# EasyEDA Pro project ProProject_Stc32f_Car副本_2024-06-03.epro, schematic schematic3_1
Create Date: 2024-03-13; Page Name: P1; Project Name: STC32F主板; Schematic Name: Schematic3; Update Date: 2024-04-25; Company: 嘉立创EDA; Page Size: A4; Version: V1.0
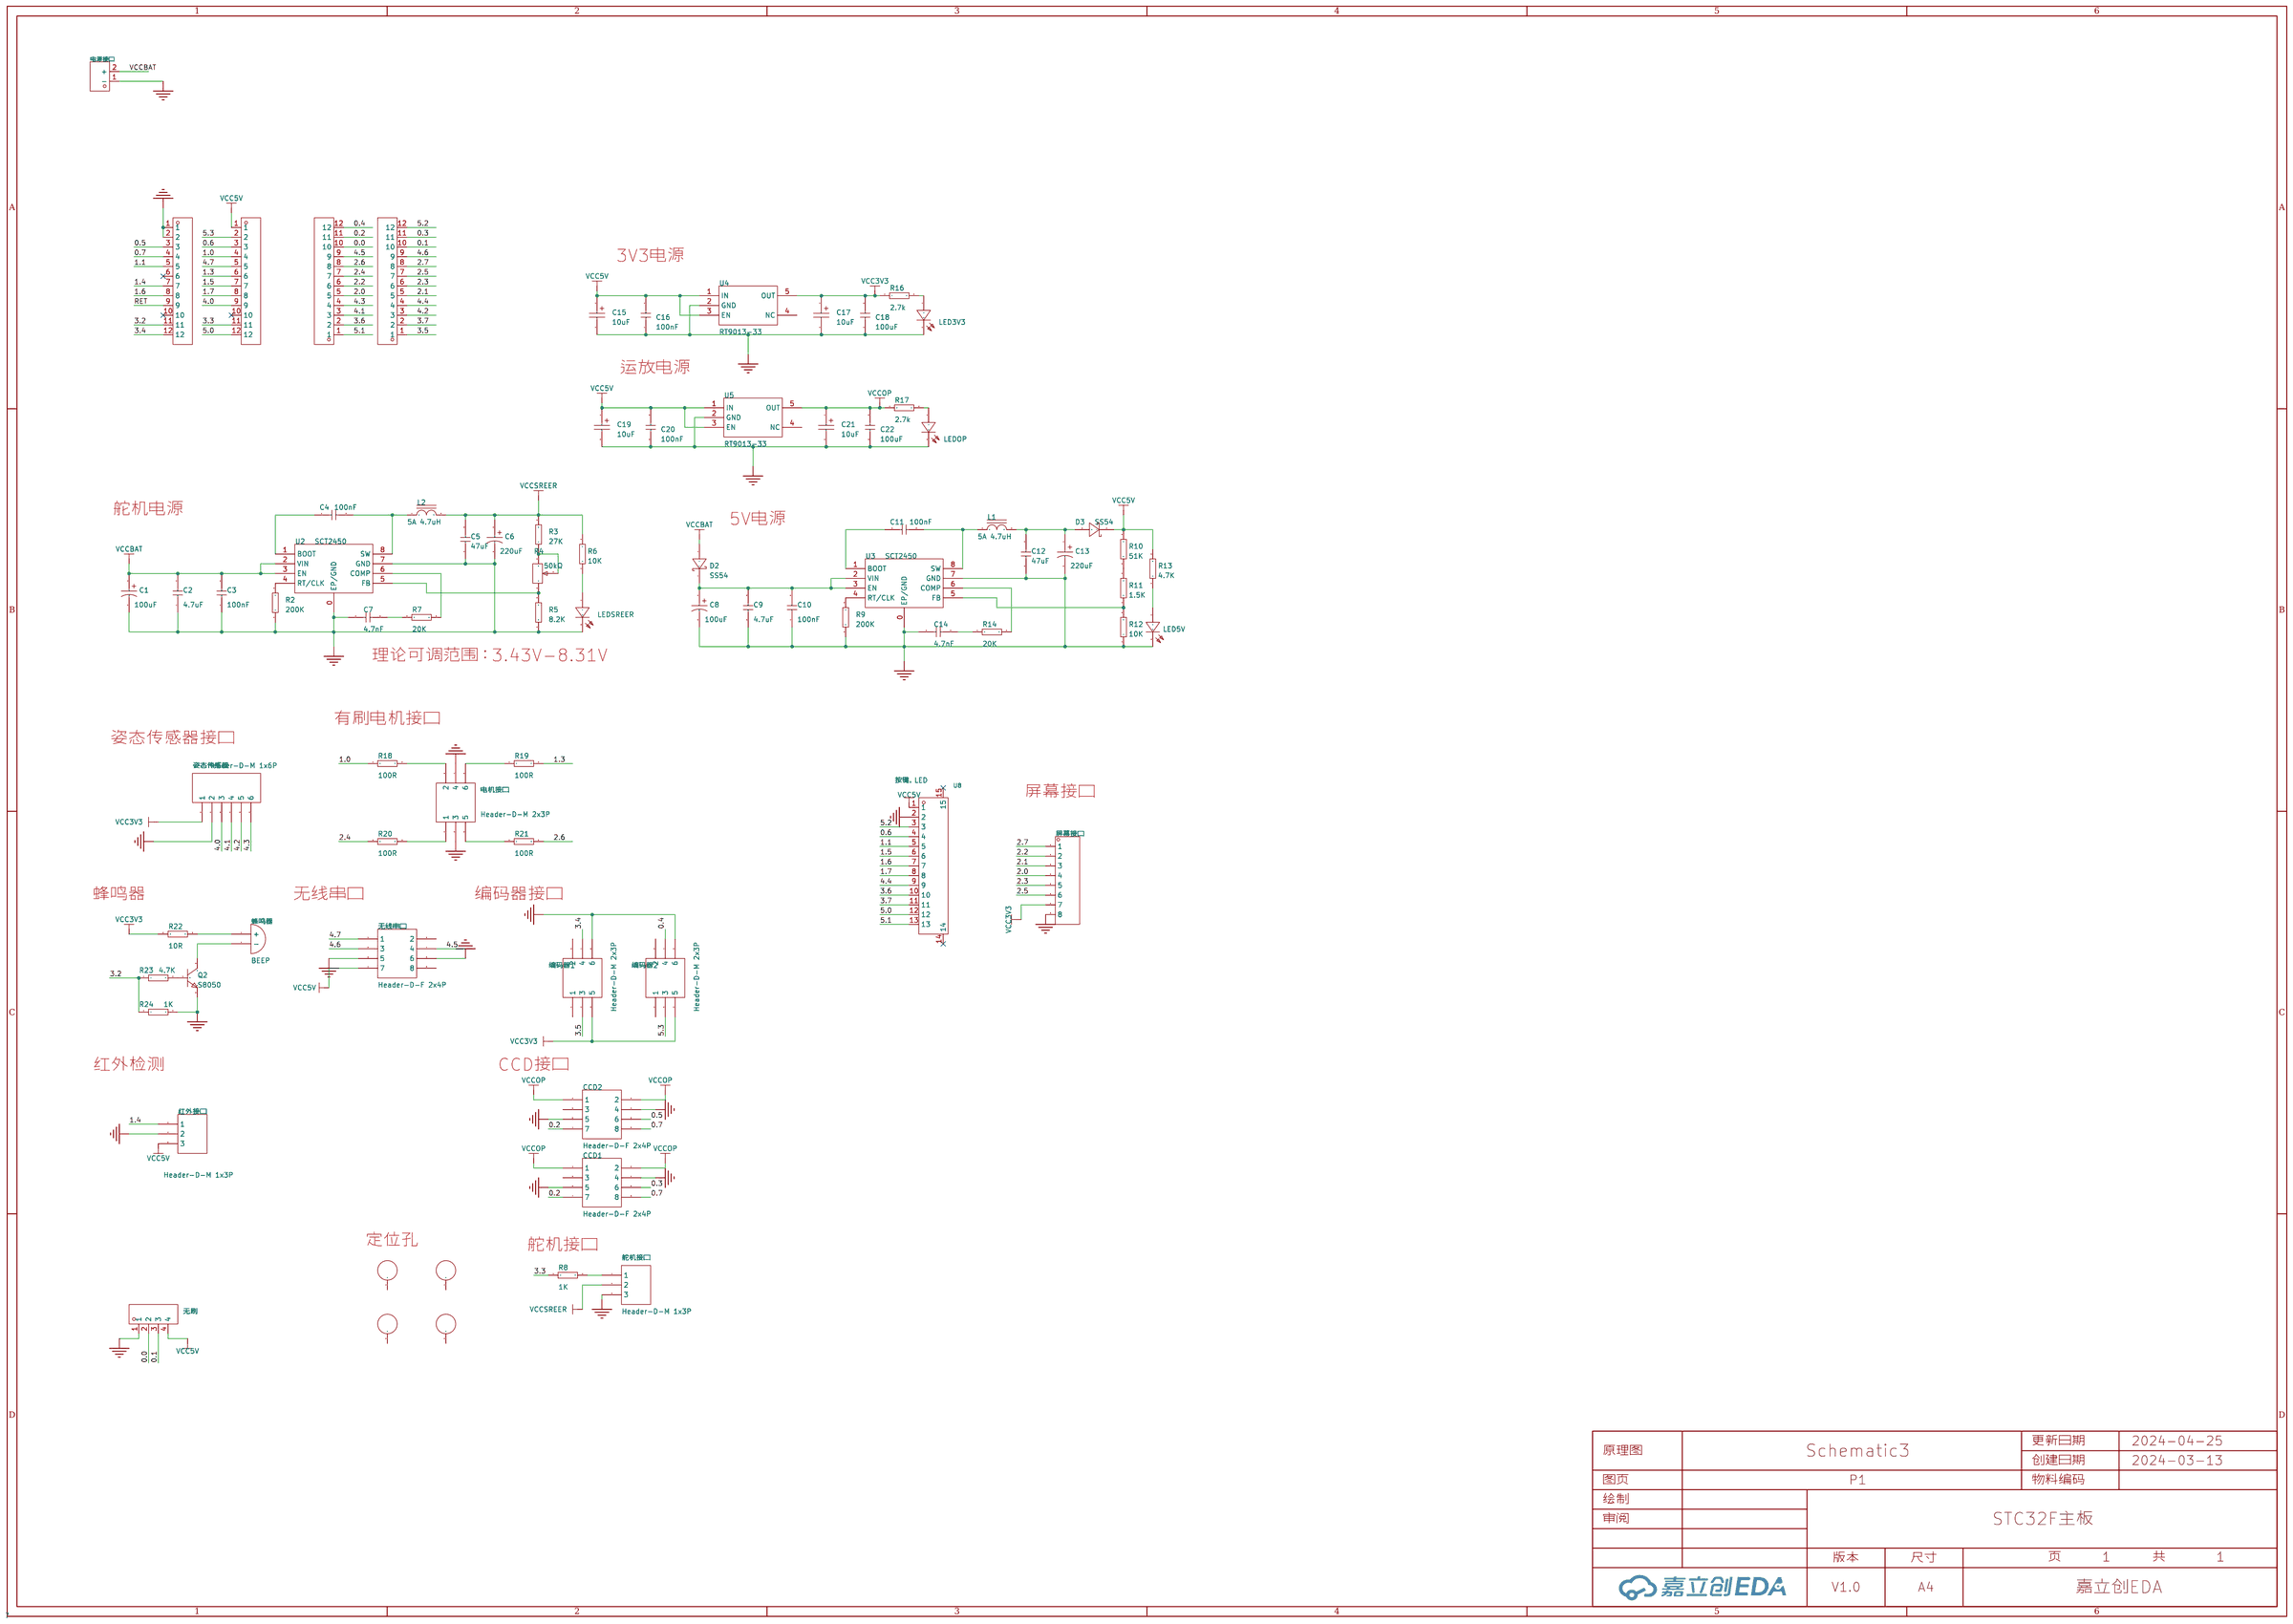
[diagram p1: schematic sheet]

## Parts
C1  100uF  [CAP-E-S 6.3]
C2  4.7uF  [CAPC3216[1206]S]
C3  100nF  [CAPC1608[0603]S-N]
C4  100nF  [CAPC1608[0603]S-N]
C5  47uF  [CAPC3216[1206]S]
C6  220uF  [CAP-E-S 6.3]
C7  4.7nF  [CAPC1608[0603]S-N]
C8  100uF  [CAP-E-S 6.3]
C9  4.7uF  [CAPC3216[1206]S]
C10  100nF  [CAPC1608[0603]S-N]
C11  100nF  [CAPC1608[0603]S-N]
C12  47uF  [CAPC3216[1206]S]
C13  220uF  [CAP-E-S 6.3]
C14  4.7nF  [CAPC1608[0603]S-N]
C15  10uF  [CAP-T-S 3216]
C16  100nF  [CAPC1608[0603]S-N]
C17  10uF  [CAP-T-S 3216]
C18  100nF  [CAPC1608[0603]S-N]
C19  10uF  [CAP-T-S 3216]
C20  100nF  [CAPC1608[0603]S-N]
C21  10uF  [CAP-T-S 3216]
C22  100nF  [CAPC1608[0603]S-N]
CCD1  Header-D-F 2x4P  [HDR2X4-F]
CCD2  Header-D-F 2x4P  [HDR2X4-F]
D2  SS54  [SMA-L[DO-214AC]]
D3  SS54  [SMA-L[DO-214AC]]
H1  -  [HDR-TH_12P-P2.54-V-F]
H2  -  [HDR-TH_12P-P2.54-V-F]
H3  -  [HDR-TH_12P-P2.54-V-F]
H4  -  [HDR-TH_12P-P2.54-V-F]
L1  4.7uH  [0630 TPC 7*7*3]
L2  4.7uH  [0630 TPC 7*7*3]
LED3V3  翠绿贴片LED  [LEDC1608(0603)-L]
LED5V  翠绿贴片LED  [LEDC1608(0603)-L]
LEDOP  翠绿贴片LED  [LEDC1608(0603)-L]
LEDSREER  翠绿贴片LED  [LEDC1608(0603)-L]
M1  MountHole  [M3-MountHole]
M2  MountHole  [M3-MountHole]
M3  MountHole  [M3-MountHole]
M4  MountHole  [M3-MountHole]
Q2  S8050  [SOT-23]
R2  200K  [RESC1608[0603]S-N]
R3  27K  [RESC1608[0603]S-N]
R4  50kΩ  [RES-ADJ-SMD_3224W]
R5  8.2K  [RESC1608[0603]S-N]
R6  10K  [RESC1608[0603]S-N]
R7  20K  [RESC1608[0603]S-N]
R8  1K  [RESC1608[0603]S-N]
R9  200K  [RESC1608[0603]S-N]
R10  51K  [RESC1608[0603]S-N]
R11  1.5K  [RESC1608[0603]S-N]
R12  10K  [RESC1608[0603]S-N]
R13  4.7K  [RESC1608[0603]S-N]
R14  20K  [RESC1608[0603]S-N]
R16  2.7K  [RESC1608[0603]S-N]
R17  2.7K  [RESC1608[0603]S-N]
R18  100R  [RESC1608[0603]S-N]
R19  100R  [RESC1608[0603]S-N]
R20  100R  [RESC1608[0603]S-N]
R21  100R  [RESC1608[0603]S-N]
R22  10R  [RESC1608[0603]S-N]
R23  4.7K  [RESC1608[0603]S-N]
R24  1K  [RESC1608[0603]S-N]
U2  SCT2450  [SOP-8E]
U3  SCT2450  [SOP-8E]
U4  RT9013-33  [SOT-23-5]
U5  RT9013-33  [SOT-23-5]
U8  按键，LED  [FPC-SMD_13P-P0.50_AFD01-S13FCA--00]
姿态传感器  Header-D-M 1x6P  [HDR1X6-M]
屏幕接口  -  [HDR-TH_8P-P2.54-V-M]
无刷  -  [HDR-TH_4P-P2.54-V-M]
无线串口  Header-D-F 2x4P  [HDR2X4-F]
电机接口  Header-D-M 2x3P  [HDR2X3-M]
电源接口  电源  [CONN-TH_XT30UPB-M]
红外接口  Header-D-M 1x3P  [HDR1X3-M]
编码器1  Header-D-M 2x3P  [HDR2X3-M]
编码器2  Header-D-M 2x3P  [HDR2X3-M]
舵机接口  Header-D-M 1x3P  [HDR1X3-M]
蜂鸣器  BEEP  [BEEP 9x5.5mm]

## Library data of the parts
C1 C8 = E-S 100uF 35V 6.3x7.7: Revision: V1.0; Type: 铝电解; Voltage: 35V
C2 C9 = 4.7uF 1206 35V X5R: Revision: V1.0; Voltage: 35V; Type: X5R; Origin Footprint 2: CAPC3216[1206]
C3 C4 C10 C11 C16 C18 C20 C22 = 100nF 0603 50V X7R: Revision: V1.0; Voltage: 50V; Type: X7R; Origin Footprint 2: CAPC1608[0603]-L; Origin Footprint 3: CAPC1608[0603]-M; Origin Footprint 4: CAPC1608[0603]-N; Origin Footprint 5: CAPC1608[0603]S-L; Origin Footprint 6: CAPC1608[0603]S-M
C5 C12 = 47uF 1206 25V X5R: Revision: V1.0; Voltage: 25V; Type: X5R; Origin Footprint 2: CAPC3216[1206]
C6 C13 = E-S 220uF 25V 6.3x7.7: Revision: V1.0; Type: 铝电解; Voltage: 25V
C7 C14 = 4.7nF 0603 50V X7R: Revision: V1.0; Voltage: 50V; Type: X7R; Origin Footprint 2: CAPC1608[0603]-L; Origin Footprint 3: CAPC1608[0603]-M; Origin Footprint 4: CAPC1608[0603]-N; Origin Footprint 5: CAPC1608[0603]S-L; Origin Footprint 6: CAPC1608[0603]S-M
C15 C17 C19 C21 = T-S 10uF 3216 16V: Revision: July-2002: Re-released for DXP Platform.; Type: TanCap; Voltage: 16V
CCD1 CCD2 无线串口 = Header-D-F 2x4P: Revision: V1.0
D2 D3 = SS54: Revision: V1.0
H1-H4 = HDR-F_2.54_1x12P: Supplier Part: C2905419; Supplier Footprint: 插件
L1 L2 = Ind-Power: Published: 8-Jun-2000; Revision: July-2002: Re-released for DXP Platform.; Publisher: Altium Limited; DCR: .5m; Price(RMB): 0.000; Imax: 5A; Origin Footprint 2: CD31; Origin Footprint 3: CD32; Origin Footprint 4: CD42; Origin Footprint 5: CD43; Origin Footprint 6: CD52; Origin Footprint 7: CD53; Origin Footprint 8: CD54; Origin Footprint 9: CD73; Origin Footprint 10: CD75; Origin Footprint 11: CD104; Origin Footprint 12: CD105; Origin Footprint 13: CD106; Origin Footprint 14: 127 Shielded 12.5*12.5*7; Origin Footprint 15: 1050 TPC 10*10*5; Origin Footprint 16: 1265 TPC 12*12*6.5; Origin Footprint 17: CD104R; Origin Footprint 18: SLO2520; Origin Footprint 19: 1365 TPC 13*13*6.5; Origin Footprint 20: INDUCTOR; Origin Footprint 21: 0402 TPC 4*4*2
LED3V3 LED5V LEDOP LEDSREER = LED Chip Green: Published: 8-Jun-2000; Revision: July-2002: Re-released for DXP Platform.; Publisher: Altium Limited; Price(RMB): 0.00; Origin Footprint 2: LEDC1608(0603); Origin Footprint 3: LEDC2012(0805); Origin Footprint 4: LEDC3216(1206); Origin Footprint 5: LEDC2012(0805)-L; Origin Footprint 6: LEDC3216(1204); Origin Footprint 7: LEDC3528-2
M1-M4 = MountHole: Origin Footprint 2: M3-MountSlot; Origin Footprint 3: M3-MountSlot-Plated; Origin Footprint 4: M3-MountHole-4mm; Origin Footprint 5: M3-MountHole-5mm; Origin Footprint 6: M3-MountHole-6mm; Origin Footprint 7: M3-MountHole-7mm; Origin Footprint 8: M3-MountHole-8mm; Origin Footprint 9: M3-MountHole-9mm; Origin Footprint 10: M3-MountHole-10mm; Origin Footprint 11: M3-MountHole-11mm; Origin Footprint 12: M3-MountHole-12mm; Origin Footprint 13: M3-MountHole-13mm; Origin Footprint 14: M3-MountHole-14mm; Origin Footprint 15: M3-MountHole-15mm; Origin Footprint 16: M3-MountHole-16mm; Origin Footprint 17: M3-MountHole-17mm; Origin Footprint 18: M3-MountHole-18mm; Origin Footprint 19: M3-MountHole-19mm; Origin Footprint 20: M3-MountHole-20mm; Origin Footprint 21: M3-MountHole-Plated-D5.2; Origin Footprint 22: M3-MountHole-Plated-D5.5; Origin Footprint 23: M3-MountHole-Plated-D6
Q2 = NPN S8050: Published: 8-Jun-2000; Revision: July-2002: Re-released for DXP Platform.; Publisher: Altium Limited; Price(RMB): 0.000
R2 R9 = Res-Chip_1: Revision: V1.0; Power: 1/8W; Tolerance: ±1%; Origin Footprint 2: RESC0603[0201]-L; Origin Footprint 3: RESC0603[0201]-M; Origin Footprint 4: RESC0603[0201]-N; Origin Footprint 5: RESC0603[0201]S-L; Origin Footprint 6: RESC0603[0201]S-M; Origin Footprint 7: RESC0603[0201]S-N; Origin Footprint 8: RESC1005[0402]-L; Origin Footprint 9: RESC1005[0402]S-M; Origin Footprint 10: RESC1005[0402]-M; Origin Footprint 11: RESC1005[0402]-N; Origin Footprint 12: RESC1005[0402]S-L; Origin Footprint 13: RESC1005[0402]S-N; Origin Footprint 14: RESC1608[0603]-L; Origin Footprint 15: RESC1608[0603]-M; Origin Footprint 16: RESC1608[0603]-N; Origin Footprint 17: RESC1608[0603]S-L; Origin Footprint 18: RESC1608[0603]S-M; Origin Footprint 19: RESC2012[0805]; Origin Footprint 20: RESC2012[0805]S-L; Origin Footprint 21: RESC2012[0805]S-M; Origin Footprint 22: RESC2012[0805]S-N; Origin Footprint 23: RESC3216[1206]; Origin Footprint 24: RESC3216[1206]S-L; Origin Footprint 25: RESC3216[1206]S-M; Origin Footprint 26: RESC3216[1206]S-N; Origin Footprint 27: RESC3225[1210]; Origin Footprint 28: RESC3225[1210]S; Origin Footprint 29: RESC5025[2010]; Origin Footprint 30: RESC5025[2010]S; Origin Footprint 31: RESC6332[2512]; Origin Footprint 32: RESC6332[2512]S
R3 = Res-Chip_7: Revision: V1.0; Power: 1/8W; Tolerance: ±1%; Origin Footprint 2: RESC0603[0201]-L; Origin Footprint 3: RESC0603[0201]-M; Origin Footprint 4: RESC0603[0201]-N; Origin Footprint 5: RESC0603[0201]S-L; Origin Footprint 6: RESC0603[0201]S-M; Origin Footprint 7: RESC0603[0201]S-N; Origin Footprint 8: RESC1005[0402]-L; Origin Footprint 9: RESC1005[0402]S-M; Origin Footprint 10: RESC1005[0402]-M; Origin Footprint 11: RESC1005[0402]-N; Origin Footprint 12: RESC1005[0402]S-L; Origin Footprint 13: RESC1005[0402]S-N; Origin Footprint 14: RESC1608[0603]-L; Origin Footprint 15: RESC1608[0603]-M; Origin Footprint 16: RESC1608[0603]-N; Origin Footprint 17: RESC1608[0603]S-L; Origin Footprint 18: RESC1608[0603]S-M; Origin Footprint 19: RESC2012[0805]; Origin Footprint 20: RESC2012[0805]S-L; Origin Footprint 21: RESC2012[0805]S-M; Origin Footprint 22: RESC2012[0805]S-N; Origin Footprint 23: RESC3216[1206]; Origin Footprint 24: RESC3216[1206]S-L; Origin Footprint 25: RESC3216[1206]S-M; Origin Footprint 26: RESC3216[1206]S-N; Origin Footprint 27: RESC3225[1210]; Origin Footprint 28: RESC3225[1210]S; Origin Footprint 29: RESC5025[2010]; Origin Footprint 30: RESC5025[2010]S; Origin Footprint 31: RESC6332[2512]; Origin Footprint 32: RESC6332[2512]S
R4 = 3224W-1-503E: 阻值:50kΩ;精度:±10%;功率:250mW;温度系数:±100ppm/℃;; LCSC Part Name: 50kΩ ±10%; Supplier Part: C48484; Manufacturer: BOURNS; Supplier Footprint: SMD; JLCPCB Part Class: 扩展库; Datasheet: https://atta.szlcsc.com/upload/public/pdf/source/20160830/1472551532733.pdf; Supplier: LCSC; Tolerance: ±10%; Power(Watts): 250mW; Temperature Coefficient: ±100ppm/℃; Turns: 12
R5 = Res-Chip_8: Revision: V1.0; Power: 1/8W; Tolerance: ±1%; Origin Footprint 2: RESC0603[0201]-L; Origin Footprint 3: RESC0603[0201]-M; Origin Footprint 4: RESC0603[0201]-N; Origin Footprint 5: RESC0603[0201]S-L; Origin Footprint 6: RESC0603[0201]S-M; Origin Footprint 7: RESC0603[0201]S-N; Origin Footprint 8: RESC1005[0402]-L; Origin Footprint 9: RESC1005[0402]S-M; Origin Footprint 10: RESC1005[0402]-M; Origin Footprint 11: RESC1005[0402]-N; Origin Footprint 12: RESC1005[0402]S-L; Origin Footprint 13: RESC1005[0402]S-N; Origin Footprint 14: RESC1608[0603]-L; Origin Footprint 15: RESC1608[0603]-M; Origin Footprint 16: RESC1608[0603]-N; Origin Footprint 17: RESC1608[0603]S-L; Origin Footprint 18: RESC1608[0603]S-M; Origin Footprint 19: RESC2012[0805]; Origin Footprint 20: RESC2012[0805]S-L; Origin Footprint 21: RESC2012[0805]S-M; Origin Footprint 22: RESC2012[0805]S-N; Origin Footprint 23: RESC3216[1206]; Origin Footprint 24: RESC3216[1206]S-L; Origin Footprint 25: RESC3216[1206]S-M; Origin Footprint 26: RESC3216[1206]S-N; Origin Footprint 27: RESC3225[1210]; Origin Footprint 28: RESC3225[1210]S; Origin Footprint 29: RESC5025[2010]; Origin Footprint 30: RESC5025[2010]S; Origin Footprint 31: RESC6332[2512]; Origin Footprint 32: RESC6332[2512]S
R6 R12 = Res-Chip: Revision: V1.0; Power: 1/8W; Tolerance: ±1%; Origin Footprint 2: RESC0603[0201]-L; Origin Footprint 3: RESC0603[0201]-M; Origin Footprint 4: RESC0603[0201]-N; Origin Footprint 5: RESC0603[0201]S-L; Origin Footprint 6: RESC0603[0201]S-M; Origin Footprint 7: RESC0603[0201]S-N; Origin Footprint 8: RESC1005[0402]-L; Origin Footprint 9: RESC1005[0402]S-M; Origin Footprint 10: RESC1005[0402]-M; Origin Footprint 11: RESC1005[0402]-N; Origin Footprint 12: RESC1005[0402]S-L; Origin Footprint 13: RESC1005[0402]S-N; Origin Footprint 14: RESC1608[0603]-L; Origin Footprint 15: RESC1608[0603]-M; Origin Footprint 16: RESC1608[0603]-N; Origin Footprint 17: RESC1608[0603]S-L; Origin Footprint 18: RESC1608[0603]S-M; Origin Footprint 19: RESC2012[0805]; Origin Footprint 20: RESC2012[0805]S-L; Origin Footprint 21: RESC2012[0805]S-M; Origin Footprint 22: RESC2012[0805]S-N; Origin Footprint 23: RESC3216[1206]; Origin Footprint 24: RESC3216[1206]S-L; Origin Footprint 25: RESC3216[1206]S-M; Origin Footprint 26: RESC3216[1206]S-N; Origin Footprint 27: RESC3225[1210]; Origin Footprint 28: RESC3225[1210]S; Origin Footprint 29: RESC5025[2010]; Origin Footprint 30: RESC5025[2010]S; Origin Footprint 31: RESC6332[2512]; Origin Footprint 32: RESC6332[2512]S
R7 R14 = Res-Chip_4: Revision: V1.0; Power: 1/8W; Tolerance: ±1%; Origin Footprint 2: RESC0603[0201]-L; Origin Footprint 3: RESC0603[0201]-M; Origin Footprint 4: RESC0603[0201]-N; Origin Footprint 5: RESC0603[0201]S-L; Origin Footprint 6: RESC0603[0201]S-M; Origin Footprint 7: RESC0603[0201]S-N; Origin Footprint 8: RESC1005[0402]-L; Origin Footprint 9: RESC1005[0402]S-M; Origin Footprint 10: RESC1005[0402]-M; Origin Footprint 11: RESC1005[0402]-N; Origin Footprint 12: RESC1005[0402]S-L; Origin Footprint 13: RESC1005[0402]S-N; Origin Footprint 14: RESC1608[0603]-L; Origin Footprint 15: RESC1608[0603]-M; Origin Footprint 16: RESC1608[0603]-N; Origin Footprint 17: RESC1608[0603]S-L; Origin Footprint 18: RESC1608[0603]S-M; Origin Footprint 19: RESC2012[0805]; Origin Footprint 20: RESC2012[0805]S-L; Origin Footprint 21: RESC2012[0805]S-M; Origin Footprint 22: RESC2012[0805]S-N; Origin Footprint 23: RESC3216[1206]; Origin Footprint 24: RESC3216[1206]S-L; Origin Footprint 25: RESC3216[1206]S-M; Origin Footprint 26: RESC3216[1206]S-N; Origin Footprint 27: RESC3225[1210]; Origin Footprint 28: RESC3225[1210]S; Origin Footprint 29: RESC5025[2010]; Origin Footprint 30: RESC5025[2010]S; Origin Footprint 31: RESC6332[2512]; Origin Footprint 32: RESC6332[2512]S
R8 R24 = Res-Chip_11: Revision: V1.0; Power: 1/8W; Tolerance: ±1%; Origin Footprint 2: RESC0603[0201]-L; Origin Footprint 3: RESC0603[0201]-M; Origin Footprint 4: RESC0603[0201]-N; Origin Footprint 5: RESC0603[0201]S-L; Origin Footprint 6: RESC0603[0201]S-M; Origin Footprint 7: RESC0603[0201]S-N; Origin Footprint 8: RESC1005[0402]-L; Origin Footprint 9: RESC1005[0402]S-M; Origin Footprint 10: RESC1005[0402]-M; Origin Footprint 11: RESC1005[0402]-N; Origin Footprint 12: RESC1005[0402]S-L; Origin Footprint 13: RESC1005[0402]S-N; Origin Footprint 14: RESC1608[0603]-L; Origin Footprint 15: RESC1608[0603]-M; Origin Footprint 16: RESC1608[0603]-N; Origin Footprint 17: RESC1608[0603]S-L; Origin Footprint 18: RESC1608[0603]S-M; Origin Footprint 19: RESC2012[0805]; Origin Footprint 20: RESC2012[0805]S-L; Origin Footprint 21: RESC2012[0805]S-M; Origin Footprint 22: RESC2012[0805]S-N; Origin Footprint 23: RESC3216[1206]; Origin Footprint 24: RESC3216[1206]S-L; Origin Footprint 25: RESC3216[1206]S-M; Origin Footprint 26: RESC3216[1206]S-N; Origin Footprint 27: RESC3225[1210]; Origin Footprint 28: RESC3225[1210]S; Origin Footprint 29: RESC5025[2010]; Origin Footprint 30: RESC5025[2010]S; Origin Footprint 31: RESC6332[2512]; Origin Footprint 32: RESC6332[2512]S
R10 = Res-Chip_2: Revision: V1.0; Power: 1/8W; Tolerance: ±1%; Origin Footprint 2: RESC0603[0201]-L; Origin Footprint 3: RESC0603[0201]-M; Origin Footprint 4: RESC0603[0201]-N; Origin Footprint 5: RESC0603[0201]S-L; Origin Footprint 6: RESC0603[0201]S-M; Origin Footprint 7: RESC0603[0201]S-N; Origin Footprint 8: RESC1005[0402]-L; Origin Footprint 9: RESC1005[0402]S-M; Origin Footprint 10: RESC1005[0402]-M; Origin Footprint 11: RESC1005[0402]-N; Origin Footprint 12: RESC1005[0402]S-L; Origin Footprint 13: RESC1005[0402]S-N; Origin Footprint 14: RESC1608[0603]-L; Origin Footprint 15: RESC1608[0603]-M; Origin Footprint 16: RESC1608[0603]-N; Origin Footprint 17: RESC1608[0603]S-L; Origin Footprint 18: RESC1608[0603]S-M; Origin Footprint 19: RESC2012[0805]; Origin Footprint 20: RESC2012[0805]S-L; Origin Footprint 21: RESC2012[0805]S-M; Origin Footprint 22: RESC2012[0805]S-N; Origin Footprint 23: RESC3216[1206]; Origin Footprint 24: RESC3216[1206]S-L; Origin Footprint 25: RESC3216[1206]S-M; Origin Footprint 26: RESC3216[1206]S-N; Origin Footprint 27: RESC3225[1210]; Origin Footprint 28: RESC3225[1210]S; Origin Footprint 29: RESC5025[2010]; Origin Footprint 30: RESC5025[2010]S; Origin Footprint 31: RESC6332[2512]; Origin Footprint 32: RESC6332[2512]S
R11 = Res-Chip_5: Revision: V1.0; Power: 1/8W; Tolerance: ±1%; Origin Footprint 2: RESC0603[0201]-L; Origin Footprint 3: RESC0603[0201]-M; Origin Footprint 4: RESC0603[0201]-N; Origin Footprint 5: RESC0603[0201]S-L; Origin Footprint 6: RESC0603[0201]S-M; Origin Footprint 7: RESC0603[0201]S-N; Origin Footprint 8: RESC1005[0402]-L; Origin Footprint 9: RESC1005[0402]S-M; Origin Footprint 10: RESC1005[0402]-M; Origin Footprint 11: RESC1005[0402]-N; Origin Footprint 12: RESC1005[0402]S-L; Origin Footprint 13: RESC1005[0402]S-N; Origin Footprint 14: RESC1608[0603]-L; Origin Footprint 15: RESC1608[0603]-M; Origin Footprint 16: RESC1608[0603]-N; Origin Footprint 17: RESC1608[0603]S-L; Origin Footprint 18: RESC1608[0603]S-M; Origin Footprint 19: RESC2012[0805]; Origin Footprint 20: RESC2012[0805]S-L; Origin Footprint 21: RESC2012[0805]S-M; Origin Footprint 22: RESC2012[0805]S-N; Origin Footprint 23: RESC3216[1206]; Origin Footprint 24: RESC3216[1206]S-L; Origin Footprint 25: RESC3216[1206]S-M; Origin Footprint 26: RESC3216[1206]S-N; Origin Footprint 27: RESC3225[1210]; Origin Footprint 28: RESC3225[1210]S; Origin Footprint 29: RESC5025[2010]; Origin Footprint 30: RESC5025[2010]S; Origin Footprint 31: RESC6332[2512]; Origin Footprint 32: RESC6332[2512]S
R13 R23 = Res-Chip_3: Revision: V1.0; Power: 1/8W; Tolerance: ±1%; Origin Footprint 2: RESC0603[0201]-L; Origin Footprint 3: RESC0603[0201]-M; Origin Footprint 4: RESC0603[0201]-N; Origin Footprint 5: RESC0603[0201]S-L; Origin Footprint 6: RESC0603[0201]S-M; Origin Footprint 7: RESC0603[0201]S-N; Origin Footprint 8: RESC1005[0402]-L; Origin Footprint 9: RESC1005[0402]S-M; Origin Footprint 10: RESC1005[0402]-M; Origin Footprint 11: RESC1005[0402]-N; Origin Footprint 12: RESC1005[0402]S-L; Origin Footprint 13: RESC1005[0402]S-N; Origin Footprint 14: RESC1608[0603]-L; Origin Footprint 15: RESC1608[0603]-M; Origin Footprint 16: RESC1608[0603]-N; Origin Footprint 17: RESC1608[0603]S-L; Origin Footprint 18: RESC1608[0603]S-M; Origin Footprint 19: RESC2012[0805]; Origin Footprint 20: RESC2012[0805]S-L; Origin Footprint 21: RESC2012[0805]S-M; Origin Footprint 22: RESC2012[0805]S-N; Origin Footprint 23: RESC3216[1206]; Origin Footprint 24: RESC3216[1206]S-L; Origin Footprint 25: RESC3216[1206]S-M; Origin Footprint 26: RESC3216[1206]S-N; Origin Footprint 27: RESC3225[1210]; Origin Footprint 28: RESC3225[1210]S; Origin Footprint 29: RESC5025[2010]; Origin Footprint 30: RESC5025[2010]S; Origin Footprint 31: RESC6332[2512]; Origin Footprint 32: RESC6332[2512]S
R16 R17 = Res-Chip_6: Revision: V1.0; Power: 1/8W; Tolerance: ±1%; Origin Footprint 2: RESC0603[0201]-L; Origin Footprint 3: RESC0603[0201]-M; Origin Footprint 4: RESC0603[0201]-N; Origin Footprint 5: RESC0603[0201]S-L; Origin Footprint 6: RESC0603[0201]S-M; Origin Footprint 7: RESC0603[0201]S-N; Origin Footprint 8: RESC1005[0402]-L; Origin Footprint 9: RESC1005[0402]S-M; Origin Footprint 10: RESC1005[0402]-M; Origin Footprint 11: RESC1005[0402]-N; Origin Footprint 12: RESC1005[0402]S-L; Origin Footprint 13: RESC1005[0402]S-N; Origin Footprint 14: RESC1608[0603]-L; Origin Footprint 15: RESC1608[0603]-M; Origin Footprint 16: RESC1608[0603]-N; Origin Footprint 17: RESC1608[0603]S-L; Origin Footprint 18: RESC1608[0603]S-M; Origin Footprint 19: RESC2012[0805]; Origin Footprint 20: RESC2012[0805]S-L; Origin Footprint 21: RESC2012[0805]S-M; Origin Footprint 22: RESC2012[0805]S-N; Origin Footprint 23: RESC3216[1206]; Origin Footprint 24: RESC3216[1206]S-L; Origin Footprint 25: RESC3216[1206]S-M; Origin Footprint 26: RESC3216[1206]S-N; Origin Footprint 27: RESC3225[1210]; Origin Footprint 28: RESC3225[1210]S; Origin Footprint 29: RESC5025[2010]; Origin Footprint 30: RESC5025[2010]S; Origin Footprint 31: RESC6332[2512]; Origin Footprint 32: RESC6332[2512]S
R18-R21 = Res-Chip_9: Revision: V1.0; Power: 1/8W; Tolerance: ±1%; Origin Footprint 2: RESC0603[0201]-L; Origin Footprint 3: RESC0603[0201]-M; Origin Footprint 4: RESC0603[0201]-N; Origin Footprint 5: RESC0603[0201]S-L; Origin Footprint 6: RESC0603[0201]S-M; Origin Footprint 7: RESC0603[0201]S-N; Origin Footprint 8: RESC1005[0402]-L; Origin Footprint 9: RESC1005[0402]S-M; Origin Footprint 10: RESC1005[0402]-M; Origin Footprint 11: RESC1005[0402]-N; Origin Footprint 12: RESC1005[0402]S-L; Origin Footprint 13: RESC1005[0402]S-N; Origin Footprint 14: RESC1608[0603]-L; Origin Footprint 15: RESC1608[0603]-M; Origin Footprint 16: RESC1608[0603]-N; Origin Footprint 17: RESC1608[0603]S-L; Origin Footprint 18: RESC1608[0603]S-M; Origin Footprint 19: RESC2012[0805]; Origin Footprint 20: RESC2012[0805]S-L; Origin Footprint 21: RESC2012[0805]S-M; Origin Footprint 22: RESC2012[0805]S-N; Origin Footprint 23: RESC3216[1206]; Origin Footprint 24: RESC3216[1206]S-L; Origin Footprint 25: RESC3216[1206]S-M; Origin Footprint 26: RESC3216[1206]S-N; Origin Footprint 27: RESC3225[1210]; Origin Footprint 28: RESC3225[1210]S; Origin Footprint 29: RESC5025[2010]; Origin Footprint 30: RESC5025[2010]S; Origin Footprint 31: RESC6332[2512]; Origin Footprint 32: RESC6332[2512]S
R22 = Res-Chip_10: Revision: V1.0; Power: 1/8W; Tolerance: ±1%; Origin Footprint 2: RESC0603[0201]-L; Origin Footprint 3: RESC0603[0201]-M; Origin Footprint 4: RESC0603[0201]-N; Origin Footprint 5: RESC0603[0201]S-L; Origin Footprint 6: RESC0603[0201]S-M; Origin Footprint 7: RESC0603[0201]S-N; Origin Footprint 8: RESC1005[0402]-L; Origin Footprint 9: RESC1005[0402]S-M; Origin Footprint 10: RESC1005[0402]-M; Origin Footprint 11: RESC1005[0402]-N; Origin Footprint 12: RESC1005[0402]S-L; Origin Footprint 13: RESC1005[0402]S-N; Origin Footprint 14: RESC1608[0603]-L; Origin Footprint 15: RESC1608[0603]-M; Origin Footprint 16: RESC1608[0603]-N; Origin Footprint 17: RESC1608[0603]S-L; Origin Footprint 18: RESC1608[0603]S-M; Origin Footprint 19: RESC2012[0805]; Origin Footprint 20: RESC2012[0805]S-L; Origin Footprint 21: RESC2012[0805]S-M; Origin Footprint 22: RESC2012[0805]S-N; Origin Footprint 23: RESC3216[1206]; Origin Footprint 24: RESC3216[1206]S-L; Origin Footprint 25: RESC3216[1206]S-M; Origin Footprint 26: RESC3216[1206]S-N; Origin Footprint 27: RESC3225[1210]; Origin Footprint 28: RESC3225[1210]S; Origin Footprint 29: RESC5025[2010]; Origin Footprint 30: RESC5025[2010]S; Origin Footprint 31: RESC6332[2512]; Origin Footprint 32: RESC6332[2512]S
U2 U3 = SP1N28STER: Revision: V1.0
U4 U5 = RT9013-33
U8 = AFD01-S13FCC-00: 锁定特性:翻盖式;触点类型:下接;触点数量:13P;间距:0.5mm;安装类型:卧贴;; LCSC Part Name: 间距:0.5mm P数:13P 翻盖式 下接; Supplier Part: C18198486; Manufacturer: JS(钜硕电子); Supplier Footprint: SMD,P=0.5mm,卧贴; Datasheet: https://atta.szlcsc.com/upload/public/pdf/source/20230921/C984413AEFF3A883511B509B58F9A1F7.pdf; Supplier: LCSC; Locking Feature: 翻盖式; Contact Type: 下接; Number of Contacts: 13P; Pitch: 0.5mm; Mounting Type: 卧贴; Height Above Board: 2mm
姿态传感器 = Header-D-M 1x6P: Revision: V1.0
屏幕接口 = HDR-M_2.54_1x8P: Supplier Part: C124381; Supplier Footprint: 插件
无刷 = HDR-M_2.54_1x4P: Supplier Part: C492403; Supplier Footprint: 插件
电机接口 编码器1 编码器2 = Header-D-M 2x3P: Revision: V1.0
电源接口 = XT30UPB-M: 类别:-;类型1:-;; LCSC Part Name: AMASS(艾迈斯)板载立式 航模锂电池控制器连接器插头 公头XT30UPB-M; Supplier Part: C428721; Manufacturer: AMASS(艾迈斯); JLCPCB Part Class: 扩展库; Datasheet: https://atta.szlcsc.com/upload/public/pdf/source/20230412/7B5DFEF57C9EA5273853390C734B3AC5.pdf; Supplier: LCSC; Brand: 艾迈斯; Type: 航模插头; Colour: 黄色; RatedVoltage: DC 500V; InterfaceType: 公头; MetalMaterial: 镀金; InsulationMaterial: PA; RatedCurrent: 15A; contact resistance: 0.65mΩ
红外接口 舵机接口 = Header-D-M 1x3P: Revision: V1.0
蜂鸣器 = BEEP: Origin Footprint 2: BEEP 12x9.5mm

## Nets
GND: C1.2 C2.1 C3.1 C5.1 C6.2 C7.1 C8.2 C9.1 C10.1 C12.1 C13.2 C14.1 C15.2 C16.1 C17.2 C18.1 C19.2 C20.1 C21.2 C22.1 CCD1.4 CCD1.5 CCD2.4 CCD2.5 H1.1 H1.2 LED3V3.C LED5V.C LEDOP.C LEDSREER.C Q2.2(E) R2.1 R5.1 R9.1 R12.1 R24.2 U2.0(EP/GND) U2.7(GND) U3.0(EP/GND) U3.7(GND) U4.2(GND) U5.2(GND) U8.2 姿态传感器.2 屏幕接口.8 无刷.1 无线串口.5 无线串口.6 电机接口.3 电机接口.4 电源接口.1(-) 红外接口.2 编码器1.6 编码器2.6 舵机接口.3
VCC3V3: C17.1 C18.2 R16.1 R22.1 U4.5(OUT) 姿态传感器.1 屏幕接口.7 编码器1.5 编码器2.5
VCC5V: C15.1 C16.2 C19.1 C20.2 D3.K H2.1 R10.2 R13.2 U4.1(IN) U4.3(EN) U5.1(IN) U5.3(EN) U8.1 无刷.4 无线串口.7 红外接口.3
VCCBAT: C1.1 C2.2 C3.2 D2.A U2.2(VIN) U2.3(EN) 电源接口.2(+)
VCCOP: C21.1 C22.2 CCD1.1 CCD1.2 CCD2.1 CCD2.2 R17.1 U5.5(OUT)
VCCSREER: C5.2 C6.1 L2.2 R3.2 R6.2 舵机接口.2
0.0: H3.10 无刷.2
0.1: H4.10 无刷.3
0.2: CCD1.7 CCD2.7 H3.11
0.3: CCD1.6 H4.11
0.4: H3.12 编码器2.4
0.5: CCD2.6 H1.3
0.6: H2.3 U8.4
0.7: CCD1.8 CCD2.8 H1.4
1.0: H2.4 R18.1
1.1: H1.5 U8.5
1.3: H2.6 R19.2
1.4: H1.7 红外接口.1
1.5: H2.7 U8.6
1.6: H1.8 U8.7
1.7: H2.8 U8.8
2.0: H3.5 屏幕接口.4
2.1: H4.5 屏幕接口.3
2.2: H3.6 屏幕接口.2
2.3: H4.6 屏幕接口.5
2.4: H3.7 R20.1
2.5: H4.7 屏幕接口.6
2.6: H3.8 R21.2
2.7: H4.8 屏幕接口.1
3.2: H1.11 R23.1 R24.1
3.3: H2.11 R8.1
3.4: H1.12 编码器1.4
3.5: H4.1 编码器1.3
3.6: H3.2 U8.10
3.7: H4.2 U8.11
4.0: H2.9 姿态传感器.3
4.1: H3.3 姿态传感器.4
4.2: H4.3 姿态传感器.5
4.3: H3.4 姿态传感器.6
4.4: H4.4 U8.9
4.5: H3.9 无线串口.4
4.6: H4.9 无线串口.3
4.7: H2.5 无线串口.1
5.0: H2.12 U8.12
5.1: H3.1 U8.13
5.2: H4.12 U8.3
5.3: H2.2 编码器2.3
RET: H1.9
$1N7355: LED3V3.A R16.2
$1N7358: R2.2 U2.4(RT/CLK)
$1N7359: C7.2 R7.1
$1N7360: C4.1 U2.1(BOOT)
$1N7361: C4.2 L2.1 U2.8(SW)
$1N7363: LEDSREER.A R6.1
$1N7364: R4.1 R5.2 U2.5(FB)
$1N7365: R7.2 U2.6(COMP)
$1N7366: R3.1 R4.2 R4.3
$1N7367: C8.1 C9.2 C10.2 D2.K U3.2(VIN) U3.3(EN)
$1N7369: C14.2 R14.1
$1N7370: C11.1 U3.1(BOOT)
$1N7371: C11.2 L1.1 U3.8(SW)
$1N7372: LED5V.A R13.1
$1N7373: R11.1 R12.2 U3.5(FB)
$1N7374: R14.2 U3.6(COMP)
$1N7375: R9.2 U3.4(RT/CLK)
$1N7378: R10.1 R11.2
$1N7382: LEDOP.A R17.2
$1N7393: R18.2 电机接口.2
$1N7394: R19.1 电机接口.6
$1N7395: R20.2 电机接口.1
$1N7396: R21.1 电机接口.5
$1N7408: R22.2 蜂鸣器.1(+)
$1N7409: Q2.1(B) R23.2
$1N7410: Q2.3(C) 蜂鸣器.2(-)
$1N7461: R8.2 舵机接口.1
$1N7466: C12.2 C13.1 D3.A L1.2

Not connected (* = marked no-connect by the designer): CCD1 3; CCD2 3; H1 6* 10*; H2 10*; M1 1; M2 1; M3 1; M4 1; U4 4(NC); U5 4(NC); U8 14* 15*; 无线串口 2 8; 编码器1 1 2; 编码器2 1 2

## Notes on the sheet
- 3V3电源
- 运放电源
- 舵机电源
- 5V电源
- 理论可调范围：3.43V-8.31V
- 有刷电机接口
- 姿态传感器接口
- 屏幕接口
- 蜂鸣器
- 无线串口
- 编码器接口
- 红外检测
- CCD接口
- 定位孔
- 舵机接口
